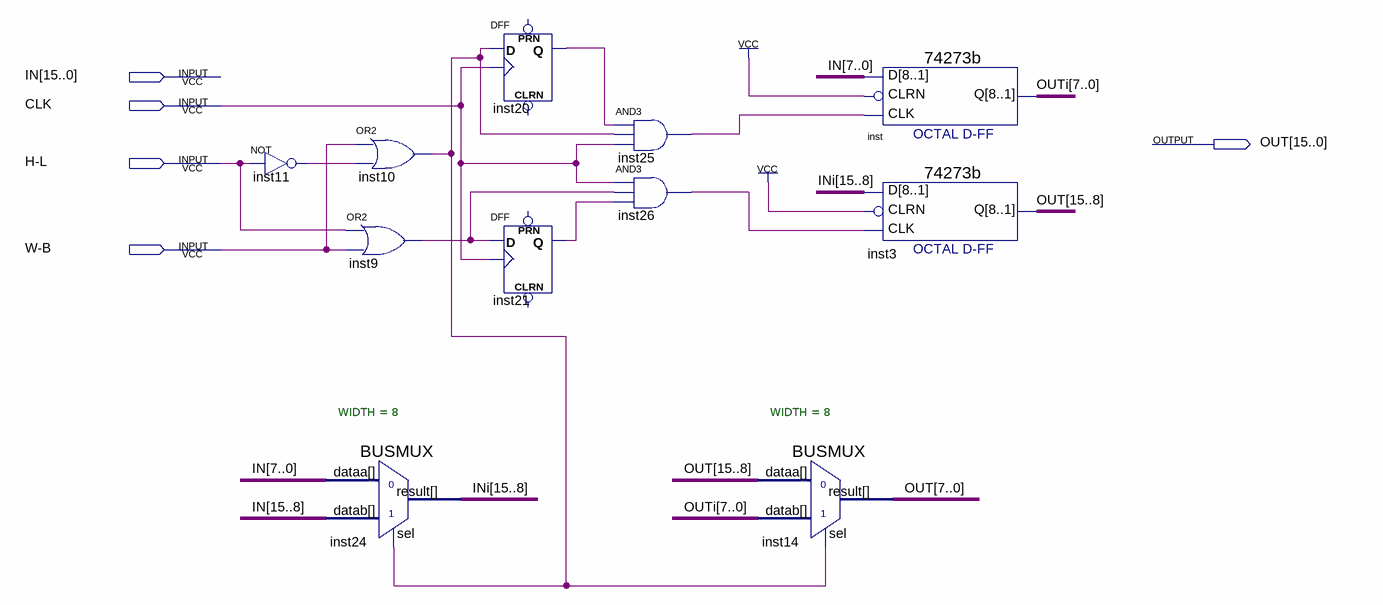
[diagram p0: schematic sheet]
// Quartus schematic Latch_Register_16bit_eq8bitX2.bdf as structural Verilog: 11 symbols, 5 pins
module Latch_Register_16bit_eq8bitX2 (
  input  [15:0] IN,
  input  CLK,
  input  \H-L ,
  input  \W-B ,
  output [15:0] OUT
);

  wire inst9_out, inst10_out, inst11_out, inst20_q, inst21_q, inst25_out, inst26_out;
  wire [7:0] OUTi;
  wire [15:8] INi;

  not inst11 (inst11_out, \H-L );
  or inst10 (inst10_out, \W-B , inst11_out);
  or inst9 (inst9_out, \H-L , \W-B );
  BUSMUX #(.WIDTH(8)) inst24 (.datab(IN[15:8]), .sel(inst10_out), .dataa(IN[7:0]), .result(INi));
  DFF inst20 (.CLK(CLK), .D(inst10_out), .Q(inst20_q));  // open: CLRN, PRN
  DFF inst21 (.CLK(CLK), .D(inst9_out), .Q(inst21_q));  // open: CLRN, PRN
  and inst25 (inst25_out, inst20_q, inst10_out, CLK);
  and inst26 (inst26_out, CLK, inst9_out, inst21_q);
  BUSMUX #(.WIDTH(8)) inst14 (.datab(OUTi), .sel(inst10_out), .dataa(OUT[15:8]), .result(OUT[7:0]));
  \74273b  inst (.CLK(inst25_out), .D(IN[7:0]), .CLRN(1'b1), .Q(OUTi));
  \74273b  inst3 (.CLK(inst26_out), .D(INi), .CLRN(1'b1), .Q(OUT[15:8]));
endmodule
